# EAGLE design upper_traced (EAGLE 9.6.2)
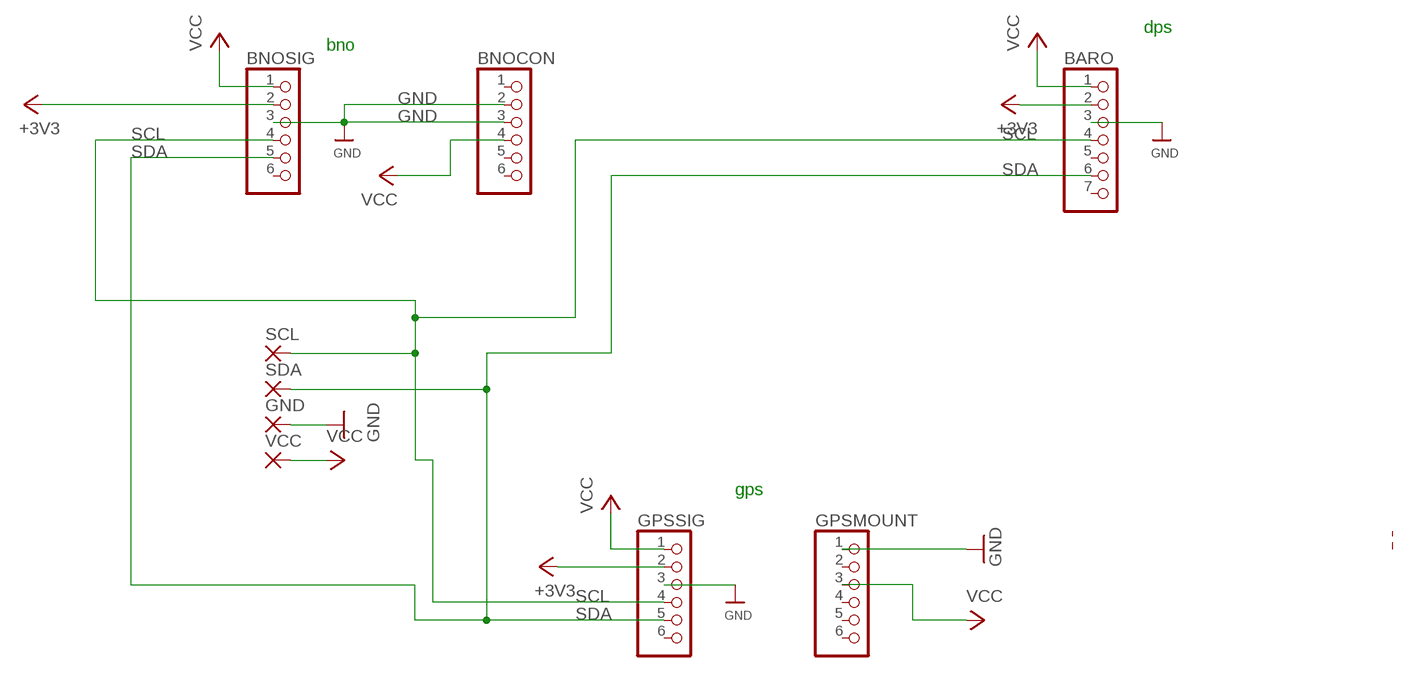
[diagram p0: schematic, sheet 1]

## Parts
BARO  HEADER-1X770MIL  [1X07_ROUND_70]
BNOCON  HEADER-1X670MIL  [1X06_ROUND_70]
BNOSIG  HEADER-1X670MIL  [1X06_ROUND_70]
GND  3,17/1,1  [3,17/1,1]
GPSMOUNT  HEADER-1X670MIL  [1X06_ROUND_70]
GPSSIG  HEADER-1X670MIL  [1X06_ROUND_70]
SCL  3,17/1,1  [3,17/1,1]
SDA  3,17/1,1  [3,17/1,1]
VCC  3,17/1,1  [3,17/1,1]

## Nets
+3V3: BARO.2 BNOSIG.2 GPSSIG.2
GND [lowpower]: BARO.3 BNOCON.2 BNOCON.3 BNOSIG.3 GND.1(P) GPSMOUNT.1 GPSSIG.3
SCL: BARO.4 BNOSIG.4 GPSSIG.4 SCL.1(P)
SDA: BARO.6 BNOSIG.5 GPSSIG.5 SDA.1(P)
VCC [lowpower]: BARO.1 BNOCON.4 BNOSIG.1 GPSMOUNT.3 GPSSIG.1 VCC.1(P)
Unconnected: BARO.5 BARO.7 BNOCON.1 BNOCON.5 BNOCON.6 BNOSIG.6 GPSMOUNT.2 GPSMOUNT.4 GPSMOUNT.5 GPSMOUNT.6 GPSSIG.6

## Notes on the sheet
- dps
- bno
- gps

## Library data of the parts
BARO = microbuilder:HEADER-1X7: PIN HEADER
BNOCON BNOSIG GPSMOUNT GPSSIG = microbuilder:HEADER-1X6: PIN HEADER
GND SCL SDA VCC = wirepad:3,17/1,1: THROUGH-HOLE PAD

## Net classes
1 highpower: width 0.406 mm, drill 0.483 mm
2 lowpower: width 0.305 mm, drill 0.483 mm

## Board
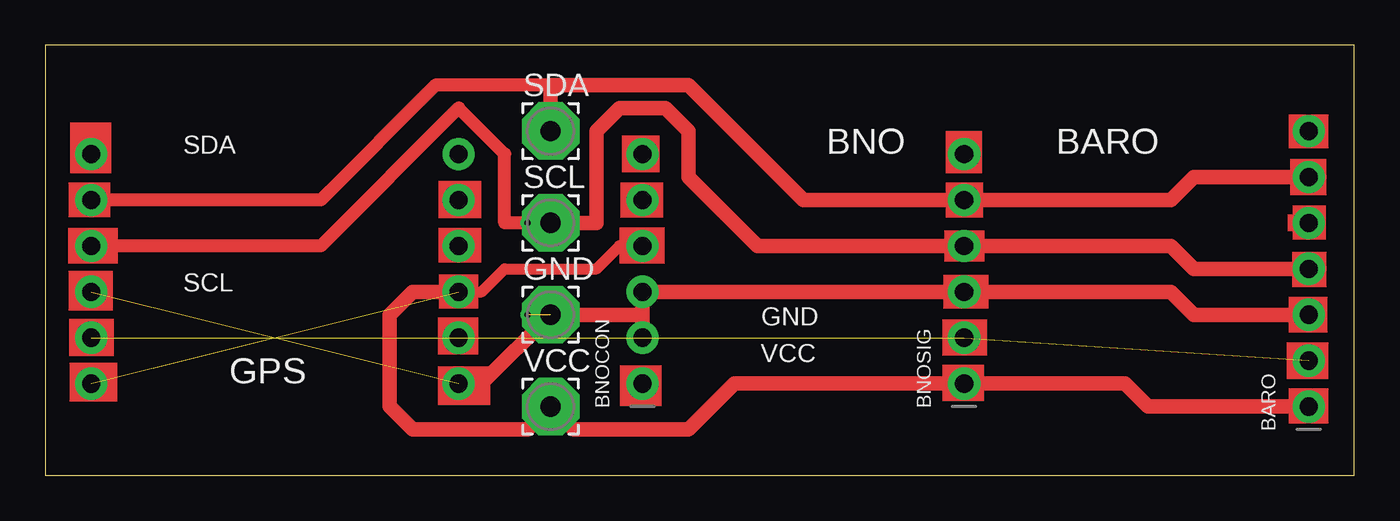
[diagram p1: board, top side]

Size 72.37 x 23.8 mm. Coordinates in mm from the lower left corner, seen from the top.
Outline: 0,0 72.37,0 72.37,23.8 0,23.8 0,0
Copper layers (1*16): Top 0.035mm / dielectric 1.5mm / Bottom 0.035mm
Design rules "default": minimum track width 6mil, minimum drill 0.35mm, track to track 6mil, track to pad 6mil, pad to pad 6mil, via to via 6mil, smd to smd 6mil, copper to edge 40mil, drill to drill 6mil, minimum pad ring 10mil, minimum via ring 8mil, stop-mask expansion 4mil, vias tented up to drill 0mil, thermal gap 10mil

### Footprints (pad centres in the part's own frame; a part is rotated, then mirrored left to right if it is on the bottom)
1X07_ROUND_70 = drill 1 pad 1.778: 1 -7.62,0; 2 -5.08,0; 3 -2.54,0; 4 0,0; 5 2.54,0; 6 5.08,0; 7 7.62,0
1X06_ROUND_70 = drill 1 pad 1.778: 1 -6.35,0; 2 -3.81,0; 3 -1.27,0; 4 1.27,0; 5 3.81,0; 6 6.35,0
3,17/1,1 = drill 1.118 pad 3.175 octagon: 1 0,0

### Placement (x,y rotation side)
BARO  69.85,11.43 90 top
BNOCON  33.02,11.43 90 top
BNOSIG  50.8,11.43 90 top
GND  27.94,8.89 0 top
GPSMOUNT  22.86,11.43 90 bottom
GPSSIG  2.54,11.43 90 bottom
SCL  27.94,13.97 0 top
SDA  27.94,19.05 0 top
VCC  27.94,3.81 0 top

### Tracks (layer width: path | path; a pad name or v marks a point on that pad's centre or on a via)
+3V3  (2 unrouted)
GND  (via drill 0.35)  (2 unrouted)
  Top 0.813: 33.02,8.89 BNOCON.3 BNOSIG.3 62.23,10.16 63.5,8.89 BARO.3 | 33.02,8.89 BNOCON.2 | 33.02,8.89 GND.1 24.13,5.08 GPSMOUNT.1
  other vias: 26.67,8.89
SCL  (via drill 0.35)
  Top 0.711: SCL.1 25.4,13.97 25.4,17.78 22.86,20.32 15.24,12.7 GPSSIG.4
  Top 0.813: BARO.4 63.5,11.43 62.23,12.7 BNOSIG.4 39.37,12.7 35.56,16.51 35.56,19.05 34.29,20.32 31.75,20.32 30.48,19.05 30.48,13.97 SCL.1 v26.67,13.97
SDA
  Top 0.711: GPSSIG.5 15.24,15.24 21.59,21.59 27.94,21.59
  Top 0.813: BARO.6 63.5,16.51 62.23,15.24 BNOSIG.5 41.91,15.24 35.56,21.59 27.94,21.59 SDA.1
VCC  (1 unrouted)
  Top 0.61: GPSMOUNT.3 24.13,10.16 25.4,11.43 30.48,11.43 31.75,12.7 BNOCON.4
  Top 0.813: BARO.1 60.96,3.81 59.69,5.08 BNOSIG.1 38.1,5.08 35.56,2.54 29.21,2.54 VCC.1 26.67,2.54 20.32,2.54 19.05,3.81 19.05,8.89 20.32,10.16 GPSMOUNT.3
(copper drawn outside any net)
  shapes: Top area x29

### Text on the board
tPlace: SDA | BNO | BARO | SCL | GND | VCC | GPS